# Altium schematic sheet DivideBy5_DC50.SCHDOC
size A; Organization: Altium Limited; Address1: L3, 12a Rodborough Rd; Address2: Frenchs Forest; Address3: NSW; Address4: Australia 2086; DocumentNumber: 3; SheetNumber: 3; SheetTotal: 3
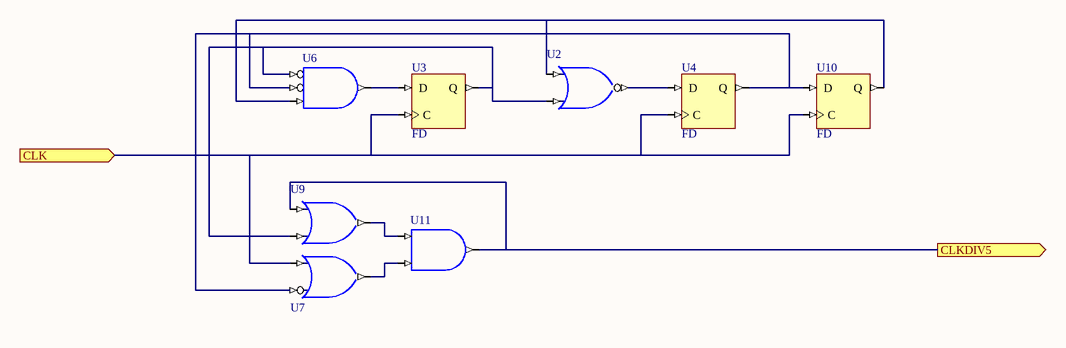
[diagram p0: DivideBy5_DC50.SCHDOC]

## Parts
U2  NOR2S  (value not drawn)
U3  FD
U4  FD
U6  AND3N2S  (value not drawn)
U7  OR2N1S  (value not drawn)
U9  OR2S  (value not drawn)
U10  FD
U11  AND2S  (value not drawn)

## Ports
CLK (in), CLKDIV5 (out)

## Nets
CLK: U3.C U4.C U7.I1 U10.C ; port CLK
CLKDIV5: U9.I0 U11.O ; port CLKDIV5
NetU2_I0: U2.I0 U6.I2 U10.Q
NetU2_I1: U2.I1 U3.Q U6.I0 U9.I1
NetU2_O: U2.O U4.D
NetU3_D: U3.D U6.O
NetU4_Q: U4.Q U6.I1 U7.I0 U10.D
NetU7_O: U7.O U11.I1
NetU9_O: U9.O U11.I0

## Notes on the sheet
- Title
- Size:
- Date:
- A
- Number:
- Time:
- Revision:
- Sheet
- of
- File:

## Library data of the parts
U2 = NOR2S: 2-Input NOR Gate, Single Pin Version; Xilinx Equivalent: NOR2; ArchiveName: GENERIC; Published: 18-Dec-2003; Publisher: Altium Limited; Core Revision: 1.00.00
U3 U4 U10 = FD: D-Type Flip-Flop; ArchiveName: GENERIC; Published: 18-Dec-2003; Publisher: Altium Limited; Xilinx Equivalent: FD; Core Revision: 1.00.00
U6 = AND3N2S: 3-Input AND Gate with Active Low A and B Inputs, Single Pin Version; Xilinx Equivalent: AND3B2; ArchiveName: GENERIC; Published: 18-Dec-2003; Publisher: Altium Limited; Core Revision: 1.00.00
U7 = OR2N1S: 2-Input OR Gate with Active Low A Input, Single Pin Version; ArchiveName: GENERIC; Xilinx Equivalent: OR2B1; Published: 18-Dec-2003; Publisher: Altium Limited; Core Revision: 1.00.00
U9 = OR2S: 2-Input OR Gate, Single Pin Version; Xilinx Equivalent: OR2; ArchiveName: GENERIC; Published: 18-Dec-2003; Publisher: Altium Limited; Core Revision: 1.00.00
U11 = AND2S: 2-Input AND Gate, Single Pin Version; Xilinx Equivalent: AND2; ArchiveName: GENERIC; Published: 18-Dec-2003; Publisher: Altium Limited; Core Revision: 1.00.00